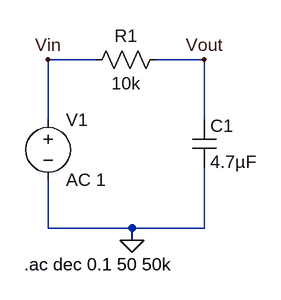
[diagram p0: schematic ms3_first_order_filter.asc]
ms3_first_order_filter.asc, the LTspice schematic file:
Version 4
SHEET 1 880 680
WIRE 64 -496 0 -496
WIRE 208 -496 144 -496
WIRE 0 -416 0 -496
WIRE 208 -416 208 -496
WIRE 0 -272 0 -336
WIRE 112 -272 0 -272
WIRE 208 -272 208 -352
WIRE 208 -272 112 -272
WIRE 112 -256 112 -272
FLAG 112 -256 0
FLAG 208 -496 Vout
FLAG 0 -496 Vin
SYMBOL res 48 -480 R270
WINDOW 0 32 56 VTop 2
WINDOW 3 0 56 VBottom 2
SYMATTR InstName R1
SYMATTR Value 10k
SYMBOL voltage 0 -432 R0
WINDOW 123 0 0 Left 0
WINDOW 39 0 0 Left 0
SYMATTR InstName V1
SYMATTR Value AC 1
SYMBOL cap 192 -416 R0
SYMATTR InstName C1
SYMATTR Value 4.7µF
TEXT -32 -224 Left 2 !.ac dec 0.1 50 50k

The netlist it stands for:
* ms3_first_order_filter.asc
R1 Vin Vout 10k
V1 Vin 0 AC 1
C1 Vout 0 4.7µF
.ac dec 0.1 50 50k
.backanno
.end